# EAGLE design MotorActuatorJack (EAGLE 7.2.0)
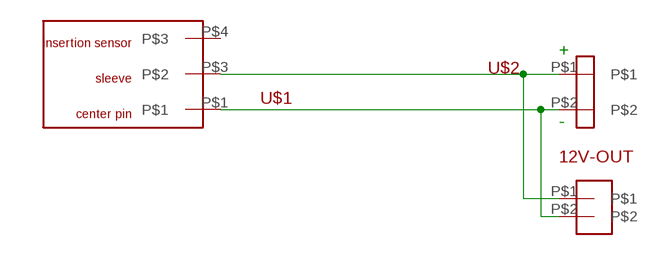
[diagram p0: schematic, sheet 1]

## Parts
12V-OUT  1X2HEADER_ROBBIE  [1X2HEADER_ROBBIE]
U$1  PJ-014CH-SMT  [PJ-014CH-SMT]
U$2  3.5MM_2PIN_SCREWTERMINAL_SPARKFUN  [1X02_3.5_SCREWTERM]

## Nets
N$1: 12V-OUT.P$1 U$1.P$3 U$2.P$1
N$6: 12V-OUT.P$2 U$1.P$1 U$2.P$2
Unconnected: U$1.P$4

## Notes on the sheet
- +
- -

## Library data of the parts
12V-OUT = robbie:1X2HEADER_ROBBIE
U$1 = robbie:PJ-014CH-SMT
U$2 = robbie:3.5MM_2PIN_SCREWTERMINAL_SPARKFUN

## Board
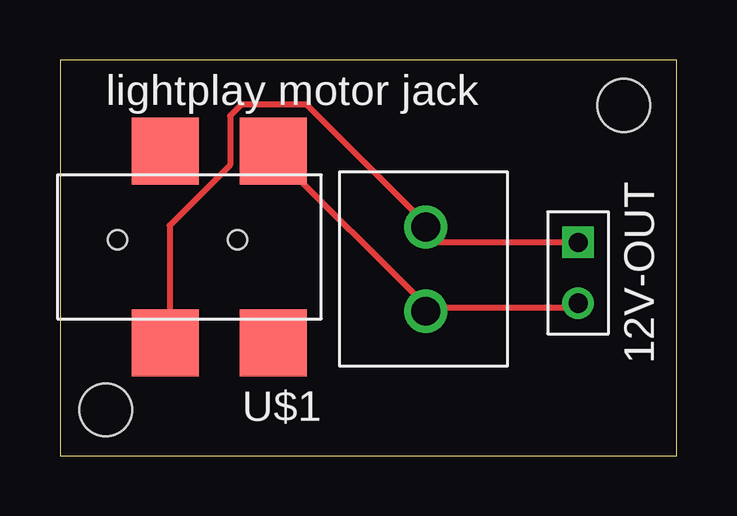
[diagram p1: board, top side]

Size 25.7 x 16.5 mm. Coordinates in mm from the lower left corner, seen from the top.
Outline: 0,0 25.7,0 25.7,16.5 0,16.5 0,0
Copper layers (1*16): Top 0.035mm / dielectric 1.5mm / Bottom 0.035mm
Design rules "default": minimum track width 10mil, minimum drill 24mil, track to track 8mil, track to pad 8mil, pad to pad 8mil, via to via 8mil, smd to smd 8mil, copper to edge 40mil, drill to drill 8mil, minimum pad ring 10mil, minimum via ring 8mil, stop-mask expansion 4mil, vias tented up to drill 0mil, thermal gap 10mil
Holes 2.2 mm at 1.91,1.91 23.5,14.61

### Footprints (pad centres in the part's own frame; a part is rotated, then mirrored left to right if it is on the bottom)
1X2HEADER_ROBBIE = drill 0.8 square: P$1 0,0 | drill 0.8: P$2 2.54,0
PJ-014CH-SMT = smd 2.8 x 2.8: P$1 0,0; P$2 4.5,0; P$3 4.5,8; P$4 0,8 | hole 0.8: 6.5,3.7; 1.5,3.7
1X02_3.5_SCREWTERM = drill 1.2: P$1 0,0; P$2 3.5,0

### Placement (x,y rotation side)
12V-OUT  21.59,8.89 270 top
U$1  8.89,12.7 180 top
U$2  15.24,9.53 270 top

### Tracks (layer width: path | path; a pad name or v marks a point on that pad's centre or on a via)
N$1
  Top 0.254: 12V-OUT.P$1 21.49,8.91 15.77,8.91 15.32,9.37 U$2.P$1 15.32,9.6 10.29,14.63 7.54,14.63 7.09,14.17 7.09,12.12 4.57,9.6 4.57,4.8 U$1.P$3
N$6
  Top 0.254: 15.32,6.17 21.49,6.17 12V-OUT.P$2 | 15.32,6.17 8.91,12.57 U$1.P$1 | 15.32,6.17 U$2.P$2

### Text on the board
tPlace: lightplay motor jack